# Altium project ATLAS_XP2V5.PrjPcb (part 2 of 2)

## Sheet PROBA.SchDoc: ATLAS_XP2V5
size 558 x 431 mm; Organization: IMP Automatika d.o.o.; Revision: V5
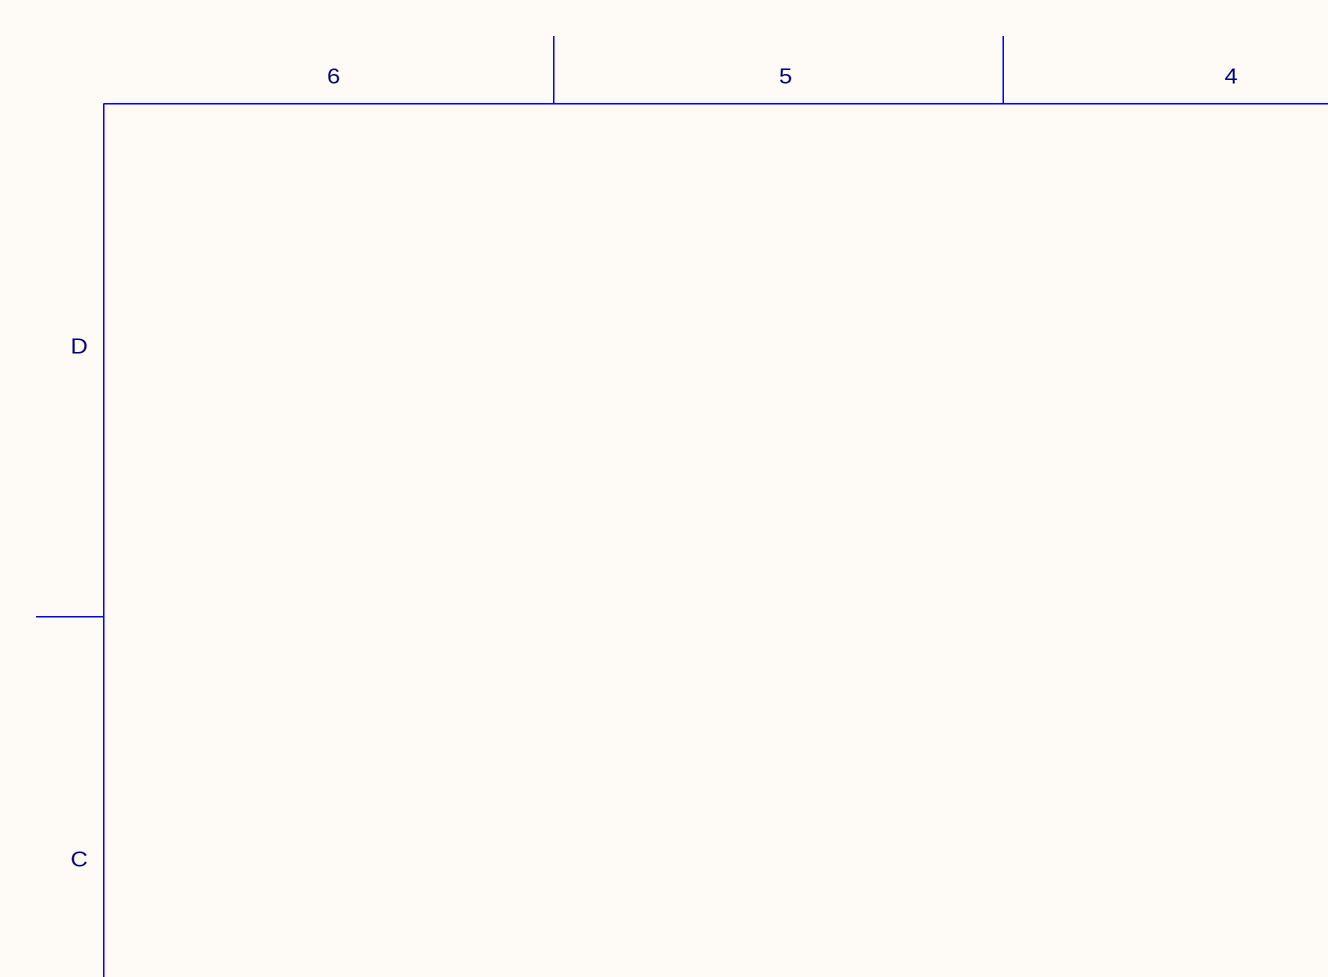
[diagram p20: PROBA.SchDoc, top left]
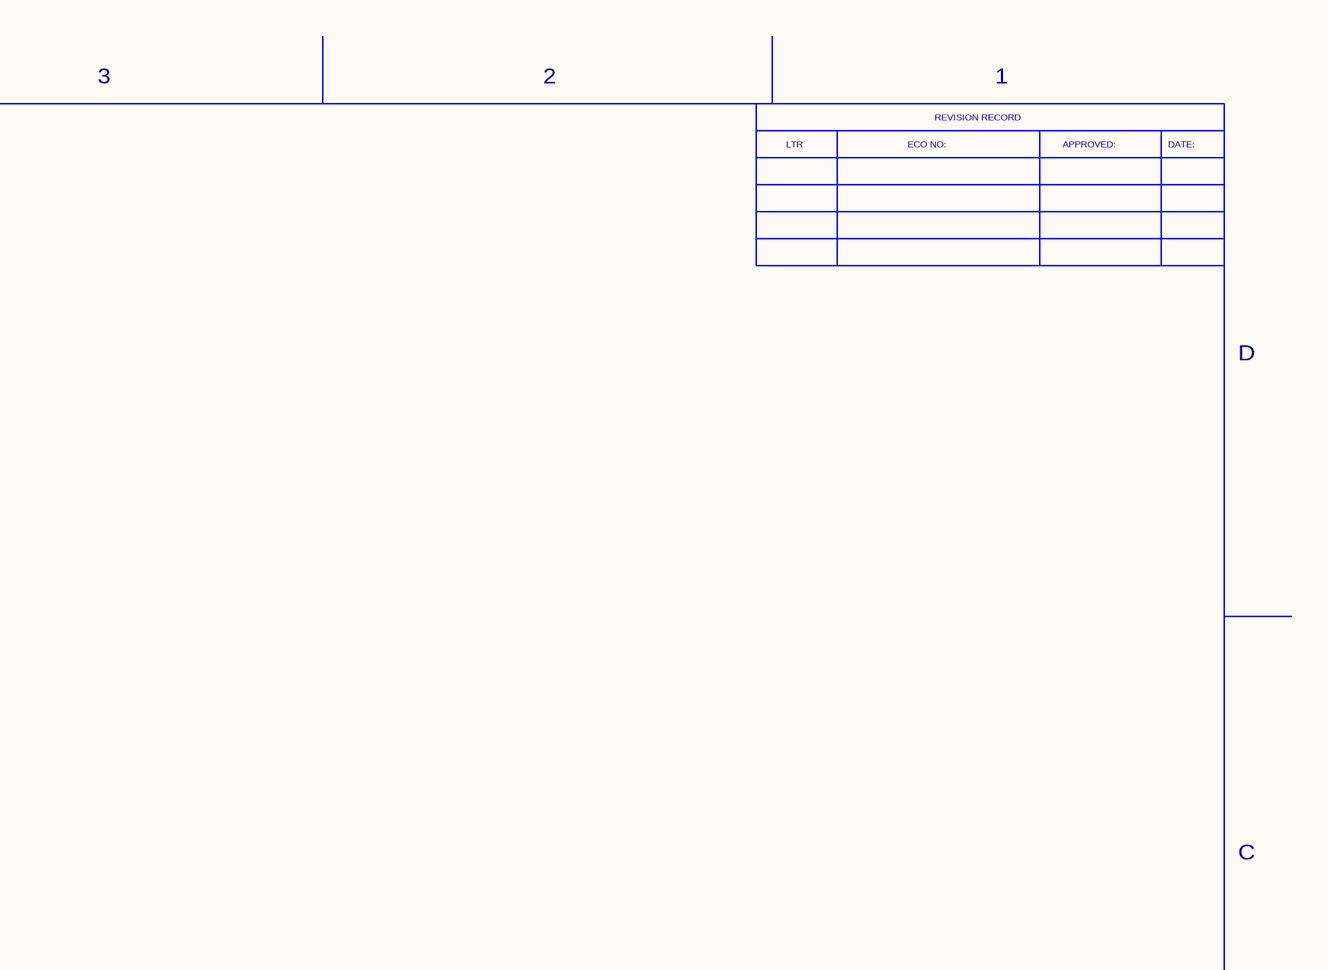
[diagram p21: PROBA.SchDoc, top right]
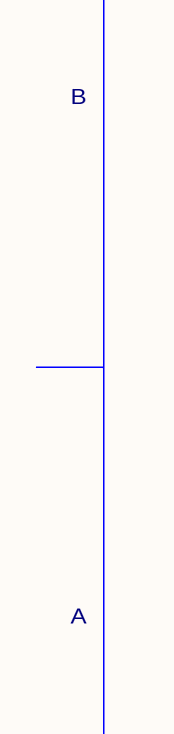
[diagram p22: PROBA.SchDoc, bottom left]
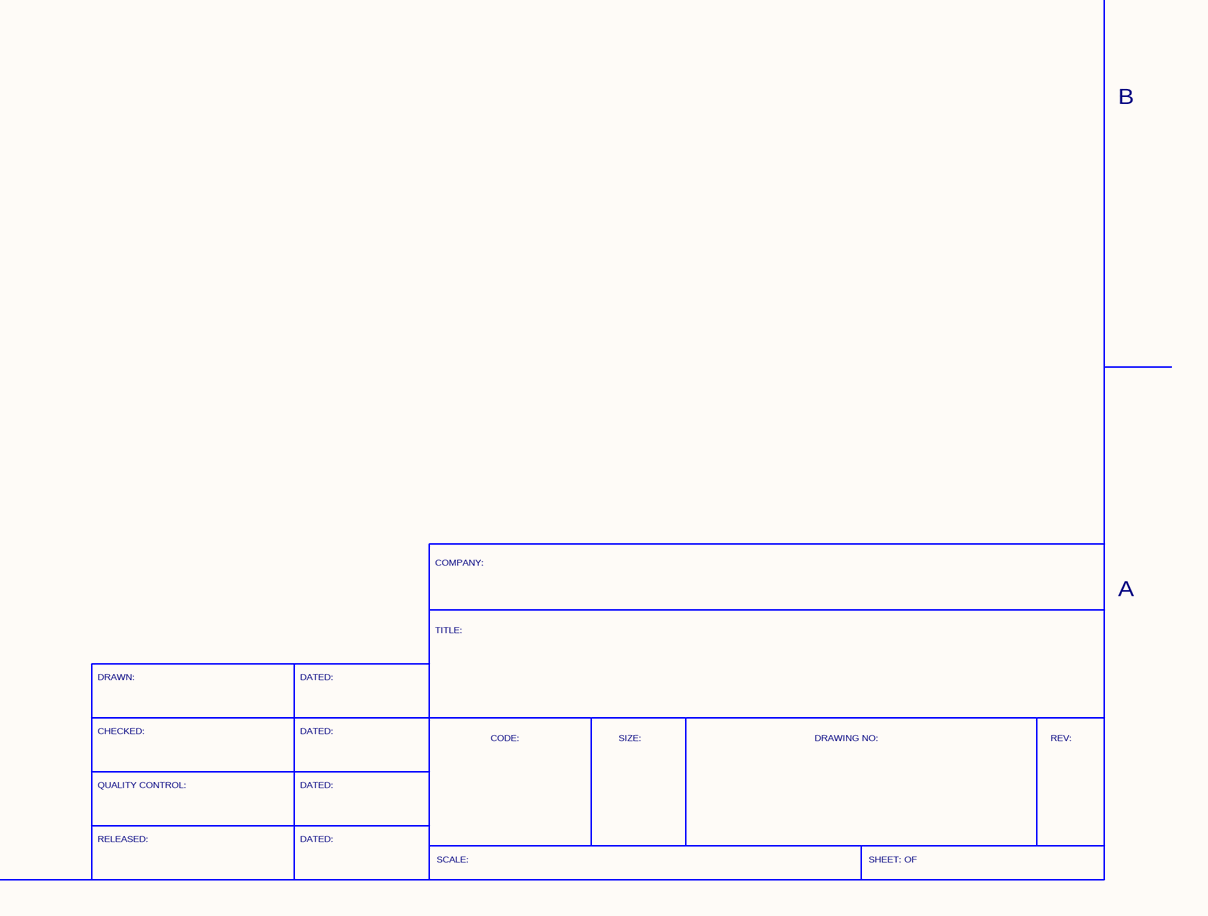
[diagram p23: PROBA.SchDoc, bottom right]

### Notes on the sheet
- 6
- 5
- 4
- 3
- 2
- 1
- LTR
- ECO NO:
- REVISION RECORD
- APPROVED:
- DATE:
- D
- C
- B
- COMPANY:
- A
- TITLE:
- DRAWN:
- DATED:
- CHECKED:
- CODE:
- SIZE:
- DRAWING NO:
- REV:
- QUALITY CONTROL:
- RELEASED:
- SCALE:
- SHEET: OF

## Nets that join several sheets
GND: MAX_BUS (15 pins), POWER_SUPPLY (9 pins), ISA_XILINX (85 pins), WDT_TASTERI_M_S (10 pins), ATLAS_XP2V5.Sheet 5 (6 pins)
VCC_3V3: ISA_XILINX (72 pins), WDT_TASTERI_M_S (R15.2 R16.1), ATLAS_XP2V5.Sheet 5 (5 pins)
VCC_+5V: MAX_BUS (48 pins), POWER_SUPPLY (6 pins), ISA_XILINX (9 pins), WDT_TASTERI_M_S (9 pins)
VCC_+12V: POWER_SUPPLY (REG1.1 S1.1), ISA_XILINX (U13.8)
VCC_-12V: POWER_SUPPLY (D2.1 REG1.2 U3.4), ISA_XILINX (R24.2)
/FLTB1: POWER_SUPPLY (R27.2 U14.4), ISA_XILINX (U11.58)
/NVRAM_RST: ISA_XILINX (U11.140), ATLAS_XP2V5.Sheet 5 (U16.1)
ADDRESS_MAX0: MAX_BUS (J16.B16 J16.C16 RN3.8), ISA_XILINX (U11.153)
ADDRESS_MAX1: MAX_BUS (J16.B17 J16.C17 RN3.7), ISA_XILINX (U11.154)
ADDRESS_MAX2: MAX_BUS (J16.B18 J16.C18 RN3.6), ISA_XILINX (U11.159)
ADDRESS_MAX3: MAX_BUS (J16.B19 J16.C19 RN3.5), ISA_XILINX (U11.160)
ADDRESS_MAX4: MAX_BUS (J16.B20 J16.C20 RN4.8), ISA_XILINX (U11.161)
ADDRESS_MAX5: MAX_BUS (J16.B21 J16.C21 RN4.7), ISA_XILINX (U11.162)
ADDRESS_MAX6: MAX_BUS (J16.B22 J16.C22 RN4.6), ISA_XILINX (U11.163)
ADDRESS_MAX7: MAX_BUS (J16.B23 J16.C23 RN4.5), ISA_XILINX (U11.164)
BALE: MAX_BUS (J16.B25 J16.C25 RN2.7), ISA_XILINX (U11.168)
BIQ_1: MAX_BUS (J16.B29 J16.C29 RN1.7), ISA_XILINX (U11.25)
BIQ_2: MAX_BUS (J16.B30 J16.C30 RN1.6), ISA_XILINX (U11.112)
BRD: MAX_BUS (J16.B27 J16.C27 RN2.5), ISA_XILINX (U11.169)
BRDY: MAX_BUS (J16.B24 J16.C24 RN2.8), ISA_XILINX (U11.110)
BWR: MAX_BUS (J16.B26 J16.C26 RN2.6), ISA_XILINX (U11.170)
CW6: ISA_XILINX (U11.147), WDT_TASTERI_M_S (JP4.1 RN9.5)
CW7_W/C: ISA_XILINX (U11.142), WDT_TASTERI_M_S (R12.1 U8.1)
DATA_MAX0: MAX_BUS (J16.B8 J16.C8 RN5.8), ISA_XILINX (U11.39)
DATA_MAX1: MAX_BUS (J16.B9 J16.C9 RN5.7), ISA_XILINX (U11.40)
DATA_MAX2: MAX_BUS (J16.B10 J16.C10 RN5.6), ISA_XILINX (U11.42)
DATA_MAX3: MAX_BUS (J16.B11 J16.C11 RN5.5), ISA_XILINX (U11.43)
DATA_MAX4: MAX_BUS (J16.B12 J16.C12 RN7.8), ISA_XILINX (U11.44)
DATA_MAX5: MAX_BUS (J16.B13 J16.C13 RN7.7), ISA_XILINX (U11.45)
DATA_MAX6: MAX_BUS (J16.B14 J16.C14 RN7.6), ISA_XILINX (U11.46)
DATA_MAX7: MAX_BUS (J16.B15 J16.C15 RN7.5), ISA_XILINX (U11.47)
DATA_MAX8: MAX_BUS (J16.A8 RN6.8), ISA_XILINX (U11.48)
DATA_MAX9: MAX_BUS (J16.A9 RN6.7), ISA_XILINX (U11.49)
DATA_MAX10: MAX_BUS (J16.A10 RN6.6), ISA_XILINX (U11.59)
DATA_MAX11: MAX_BUS (J16.A11 RN6.5), ISA_XILINX (U11.60)
DATA_MAX12: MAX_BUS (J16.A12 RN8.8), ISA_XILINX (U11.61)
DATA_MAX13: MAX_BUS (J16.A13 RN8.7), ISA_XILINX (U11.62)
DATA_MAX14: MAX_BUS (J16.A14 RN8.6), ISA_XILINX (U11.64)
DATA_MAX15: MAX_BUS (J16.A15 RN8.5), ISA_XILINX (U11.65)
IQ_I_SYN: MAX_BUS (US3.13), ISA_XILINX (U11.66)
IQ_O_ATP: MAX_BUS (7 pins), ISA_XILINX (U11.26)
IQ_O_SYN: MAX_BUS (7 pins), ISA_XILINX (U11.67)
IRQ9: MAX_BUS (JP1.1 JP2.1), ISA_XILINX (S3.B4)
IRQ10: MAX_BUS (JP1.3 JP2.3), ISA_XILINX (S3.D3)
IRQ11: MAX_BUS (JP1.5 JP2.5), ISA_XILINX (S3.D4)
IRQ12: MAX_BUS (JP1.7 JP2.7), ISA_XILINX (S3.D5)
IRQ14: MAX_BUS (JP1.11 JP2.11), ISA_XILINX (S3.D7)
IRQ15: MAX_BUS (JP1.9 JP2.9), ISA_XILINX (S3.D6)
MASTER_ENABLE: ISA_XILINX (U11.113), WDT_TASTERI_M_S (U10.2)
MRST: MAX_BUS (J16.B28 J16.C28 RN1.8), ISA_XILINX (U11.141)
MS_IN_1: ISA_XILINX (U11.88), WDT_TASTERI_M_S (J2.3 R15.1)
NVRAM_ADDRESS0: ISA_XILINX (U11.129), ATLAS_XP2V5.Sheet 5 (U15.14)
NVRAM_ADDRESS1: ISA_XILINX (U11.128), ATLAS_XP2V5.Sheet 5 (U15.13)
NVRAM_ADDRESS2: ISA_XILINX (U11.126), ATLAS_XP2V5.Sheet 5 (U15.12)
NVRAM_ADDRESS3: ISA_XILINX (U11.124), ATLAS_XP2V5.Sheet 5 (U15.11)
NVRAM_ADDRESS4: ISA_XILINX (U11.123), ATLAS_XP2V5.Sheet 5 (U15.10)
NVRAM_ADDRESS5: ISA_XILINX (U11.122), ATLAS_XP2V5.Sheet 5 (U15.9)
NVRAM_ADDRESS6: ISA_XILINX (U11.121), ATLAS_XP2V5.Sheet 5 (U15.8)
NVRAM_ADDRESS7: ISA_XILINX (U11.120), ATLAS_XP2V5.Sheet 5 (U15.7)
NVRAM_ADDRESS8: ISA_XILINX (U11.119), ATLAS_XP2V5.Sheet 5 (U15.29)
NVRAM_ADDRESS9: ISA_XILINX (U11.102), ATLAS_XP2V5.Sheet 5 (U15.28)
NVRAM_ADDRESS10: ISA_XILINX (U11.101), ATLAS_XP2V5.Sheet 5 (U15.25)
NVRAM_ADDRESS11: ISA_XILINX (U11.100), ATLAS_XP2V5.Sheet 5 (U15.27)
NVRAM_ADDRESS12: ISA_XILINX (U11.99), ATLAS_XP2V5.Sheet 5 (U15.6)
NVRAM_ADDRESS13: ISA_XILINX (U11.98), ATLAS_XP2V5.Sheet 5 (U15.30)
NVRAM_ADDRESS14: ISA_XILINX (U11.97), ATLAS_XP2V5.Sheet 5 (U15.5)
NVRAM_ADDRESS15: ISA_XILINX (U11.96), ATLAS_XP2V5.Sheet 5 (U15.33)
NVRAM_ADDRESS16: ISA_XILINX (U11.95), ATLAS_XP2V5.Sheet 5 (U15.4)
NVRAM_ADDRESS17: ISA_XILINX (U11.93), ATLAS_XP2V5.Sheet 5 (U15.32)
NVRAM_ADDRESS18: ISA_XILINX (U11.92), ATLAS_XP2V5.Sheet 5 (U15.3)
NVRAM_ADDRESS19: ISA_XILINX (U11.91), ATLAS_XP2V5.Sheet 5 (U15.35)
NVRAM_ADDRESS20: ISA_XILINX (U11.90), ATLAS_XP2V5.Sheet 5 (U15.2)
NVRAM_CE: ISA_XILINX (U11.133), ATLAS_XP2V5.Sheet 5 (U15.24)
NVRAM_DATA0: ISA_XILINX (U11.188), ATLAS_XP2V5.Sheet 5 (U15.15)
NVRAM_DATA1: ISA_XILINX (U11.190), ATLAS_XP2V5.Sheet 5 (U15.16)
NVRAM_DATA2: ISA_XILINX (U11.192), ATLAS_XP2V5.Sheet 5 (U15.17)
NVRAM_DATA3: ISA_XILINX (U11.193), ATLAS_XP2V5.Sheet 5 (U15.19)
NVRAM_DATA4: ISA_XILINX (U11.194), ATLAS_XP2V5.Sheet 5 (U15.20)
NVRAM_DATA5: ISA_XILINX (U11.195), ATLAS_XP2V5.Sheet 5 (U15.21)
NVRAM_DATA6: ISA_XILINX (U11.196), ATLAS_XP2V5.Sheet 5 (U15.22)
NVRAM_DATA7: ISA_XILINX (U11.197), ATLAS_XP2V5.Sheet 5 (U15.23)
NVRAM_OE: ISA_XILINX (U11.136), ATLAS_XP2V5.Sheet 5 (U15.26)
NVRAM_RST: ISA_XILINX (U11.178), ATLAS_XP2V5.Sheet 5 (U16.3)
NVRAM_WE: ISA_XILINX (U11.137), ATLAS_XP2V5.Sheet 5 (U15.31)
PPM_NOVI: MAX_BUS (R2.2 U2.4 US3.1), ISA_XILINX (U11.57)
PWR_GOOD_TPS: POWER_SUPPLY (R28.2 U14.14), ISA_XILINX (U11.149)
RESERVE1: ISA_XILINX (U11.114), WDT_TASTERI_M_S (J5.2 J6.2)
RESERVE2: ISA_XILINX (U11.115), WDT_TASTERI_M_S (J7.2 J8.2)
RESET_CPU: ISA_XILINX (U11.111), WDT_TASTERI_M_S (JP5.1 RN9.8 U9.1)
WDT_OUT_STARI: ISA_XILINX (U11.56), WDT_TASTERI_M_S (U1.5)
WDT_SIG_STARI: ISA_XILINX (U11.68), WDT_TASTERI_M_S (U1.4)
WDT_TRG: ISA_XILINX (U11.55), WDT_TASTERI_M_S (U1.1)
XP_PRESENT_IN: ISA_XILINX (RN10.5 U11.89), WDT_TASTERI_M_S (J2.6)
XP_PRESENT_OUT: ISA_XILINX (S2.8), WDT_TASTERI_M_S (J2.2)